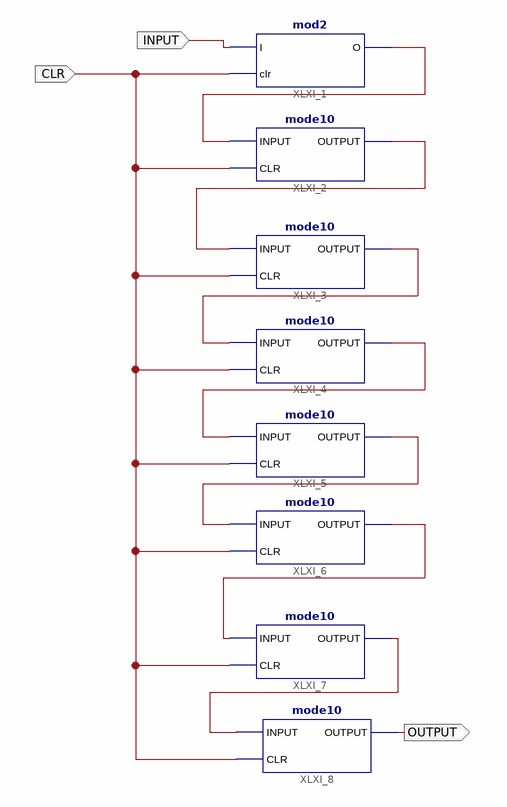
[diagram p0: schematic sheet 1]
// Xilinx ISE schematic Div20M.sch (spartan6) as structural Verilog: 8 symbols, 3 ports
module Div20M (
  input  INPUT,
  input  CLR,
  output OUTPUT
);

  wire XLXN_1, XLXN_2, XLXN_3, XLXN_4, XLXN_5, XLXN_7, XLXN_17;

  mod2 XLXI_1 (.I(INPUT), .clr(CLR), .O(XLXN_1));
  mode10 XLXI_2 (.INPUT(XLXN_1), .OUTPUT(XLXN_2), .CLR(CLR));
  mode10 XLXI_3 (.INPUT(XLXN_2), .OUTPUT(XLXN_3), .CLR(CLR));
  mode10 XLXI_4 (.INPUT(XLXN_3), .OUTPUT(XLXN_4), .CLR(CLR));
  mode10 XLXI_5 (.INPUT(XLXN_4), .OUTPUT(XLXN_5), .CLR(CLR));
  mode10 XLXI_6 (.INPUT(XLXN_5), .OUTPUT(XLXN_17), .CLR(CLR));
  mode10 XLXI_8 (.INPUT(XLXN_7), .OUTPUT(OUTPUT), .CLR(CLR));
  mode10 XLXI_7 (.INPUT(XLXN_17), .OUTPUT(XLXN_7), .CLR(CLR));
endmodule
